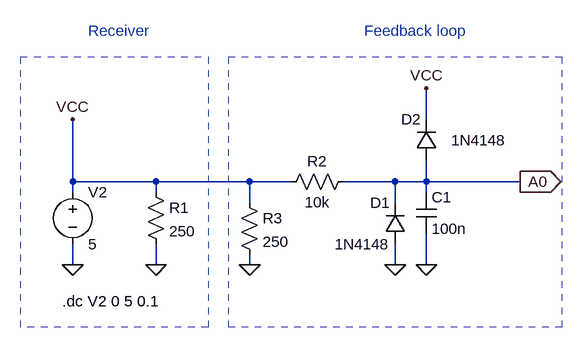
[diagram p0: schematic feedbackLoop.asc]
feedbackLoop.asc, the LTspice schematic file:
Version 4
SHEET 1 880 680
WIRE 0 224 0 176
WIRE -544 320 -544 224
WIRE -416 320 -544 320
WIRE -272 320 -416 320
WIRE -208 320 -272 320
WIRE -48 320 -128 320
WIRE 0 320 0 288
WIRE 0 320 -48 320
WIRE 144 320 0 320
WIRE -544 336 -544 320
WIRE -416 336 -416 320
WIRE 0 336 0 320
WIRE -272 352 -272 320
WIRE -48 352 -48 320
WIRE -544 448 -544 416
WIRE -416 448 -416 416
WIRE -272 448 -272 432
WIRE -48 448 -48 416
WIRE 0 448 0 400
FLAG -416 448 0
FLAG -544 448 0
FLAG -272 448 0
FLAG -544 224 VCC
FLAG 0 176 VCC
FLAG -48 448 0
FLAG 0 448 0
FLAG 144 320 A0
IOPIN 144 320 Out
SYMBOL res -432 320 R0
SYMATTR InstName R1
SYMATTR Value 250
SYMBOL res -112 304 R90
WINDOW 0 0 56 VBottom 2
WINDOW 3 32 56 VTop 2
SYMATTR InstName R2
SYMATTR Value 10k
SYMBOL cap -16 336 R0
SYMATTR InstName C1
SYMATTR Value 100n
SYMBOL diode -32 416 R180
WINDOW 0 24 64 Left 2
WINDOW 3 24 0 Left 2
SYMATTR InstName D1
SYMATTR Value 1N4148
SYMBOL diode 16 288 R180
WINDOW 0 24 64 Left 2
WINDOW 3 -107 32 Left 2
SYMATTR InstName D2
SYMATTR Value 1N4148
SYMBOL voltage -544 320 R0
WINDOW 123 0 0 Left 0
WINDOW 39 0 0 Left 0
SYMATTR InstName V2
SYMATTR Value 5
SYMBOL res -288 336 R0
SYMATTR InstName R3
SYMATTR Value 250
TEXT -560 504 Left 2 !.dc V2 0 5 0.1
TEXT -520 88 Left 2 ;Receiver
TEXT -96 88 Left 2 ;Feedback loop
RECTANGLE Normal -336 544 -624 128 1
RECTANGLE Normal 208 544 -304 128 1

The netlist it stands for:
* feedbackLoop.asc
R1 VCC 0 250
R2 A0 VCC 10k
C1 A0 0 100n
D1 0 A0 1N4148
D2 A0 VCC 1N4148
V2 VCC 0 5
R3 VCC 0 250
.model D D
.lib standard.dio
.dc V2 0 5 0.1
* Receiver
* Feedback loop
.backanno
.end

* Results of the author's LTspice run, read from the files saved beside the schematic
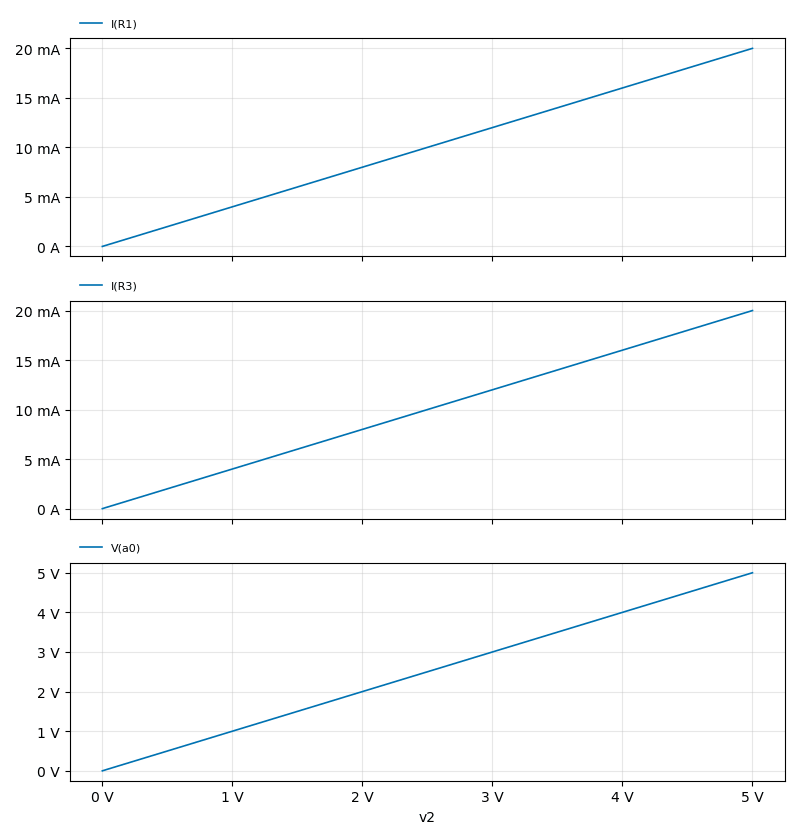
[diagram p1: DC transfer characteristic of feedbackLoop.asc, plotted from the saved traces]
* DC transfer characteristic, 1 run:
*   I(R1): 0 A at v2=0 V, 20 mA at v2=5 V, min 0 A, max 20 mA
*   I(R3): 0 A at v2=0 V, 20 mA at v2=5 V, min 0 A, max 20 mA
*   V(a0): 0 V at v2=0 V, 5 V at v2=5 V, min 0 V, max 5 V